# Altium project Ultrascale.PrjPcb (part 3 of 3)

## Sheet Sheet13.SchDoc
size A3
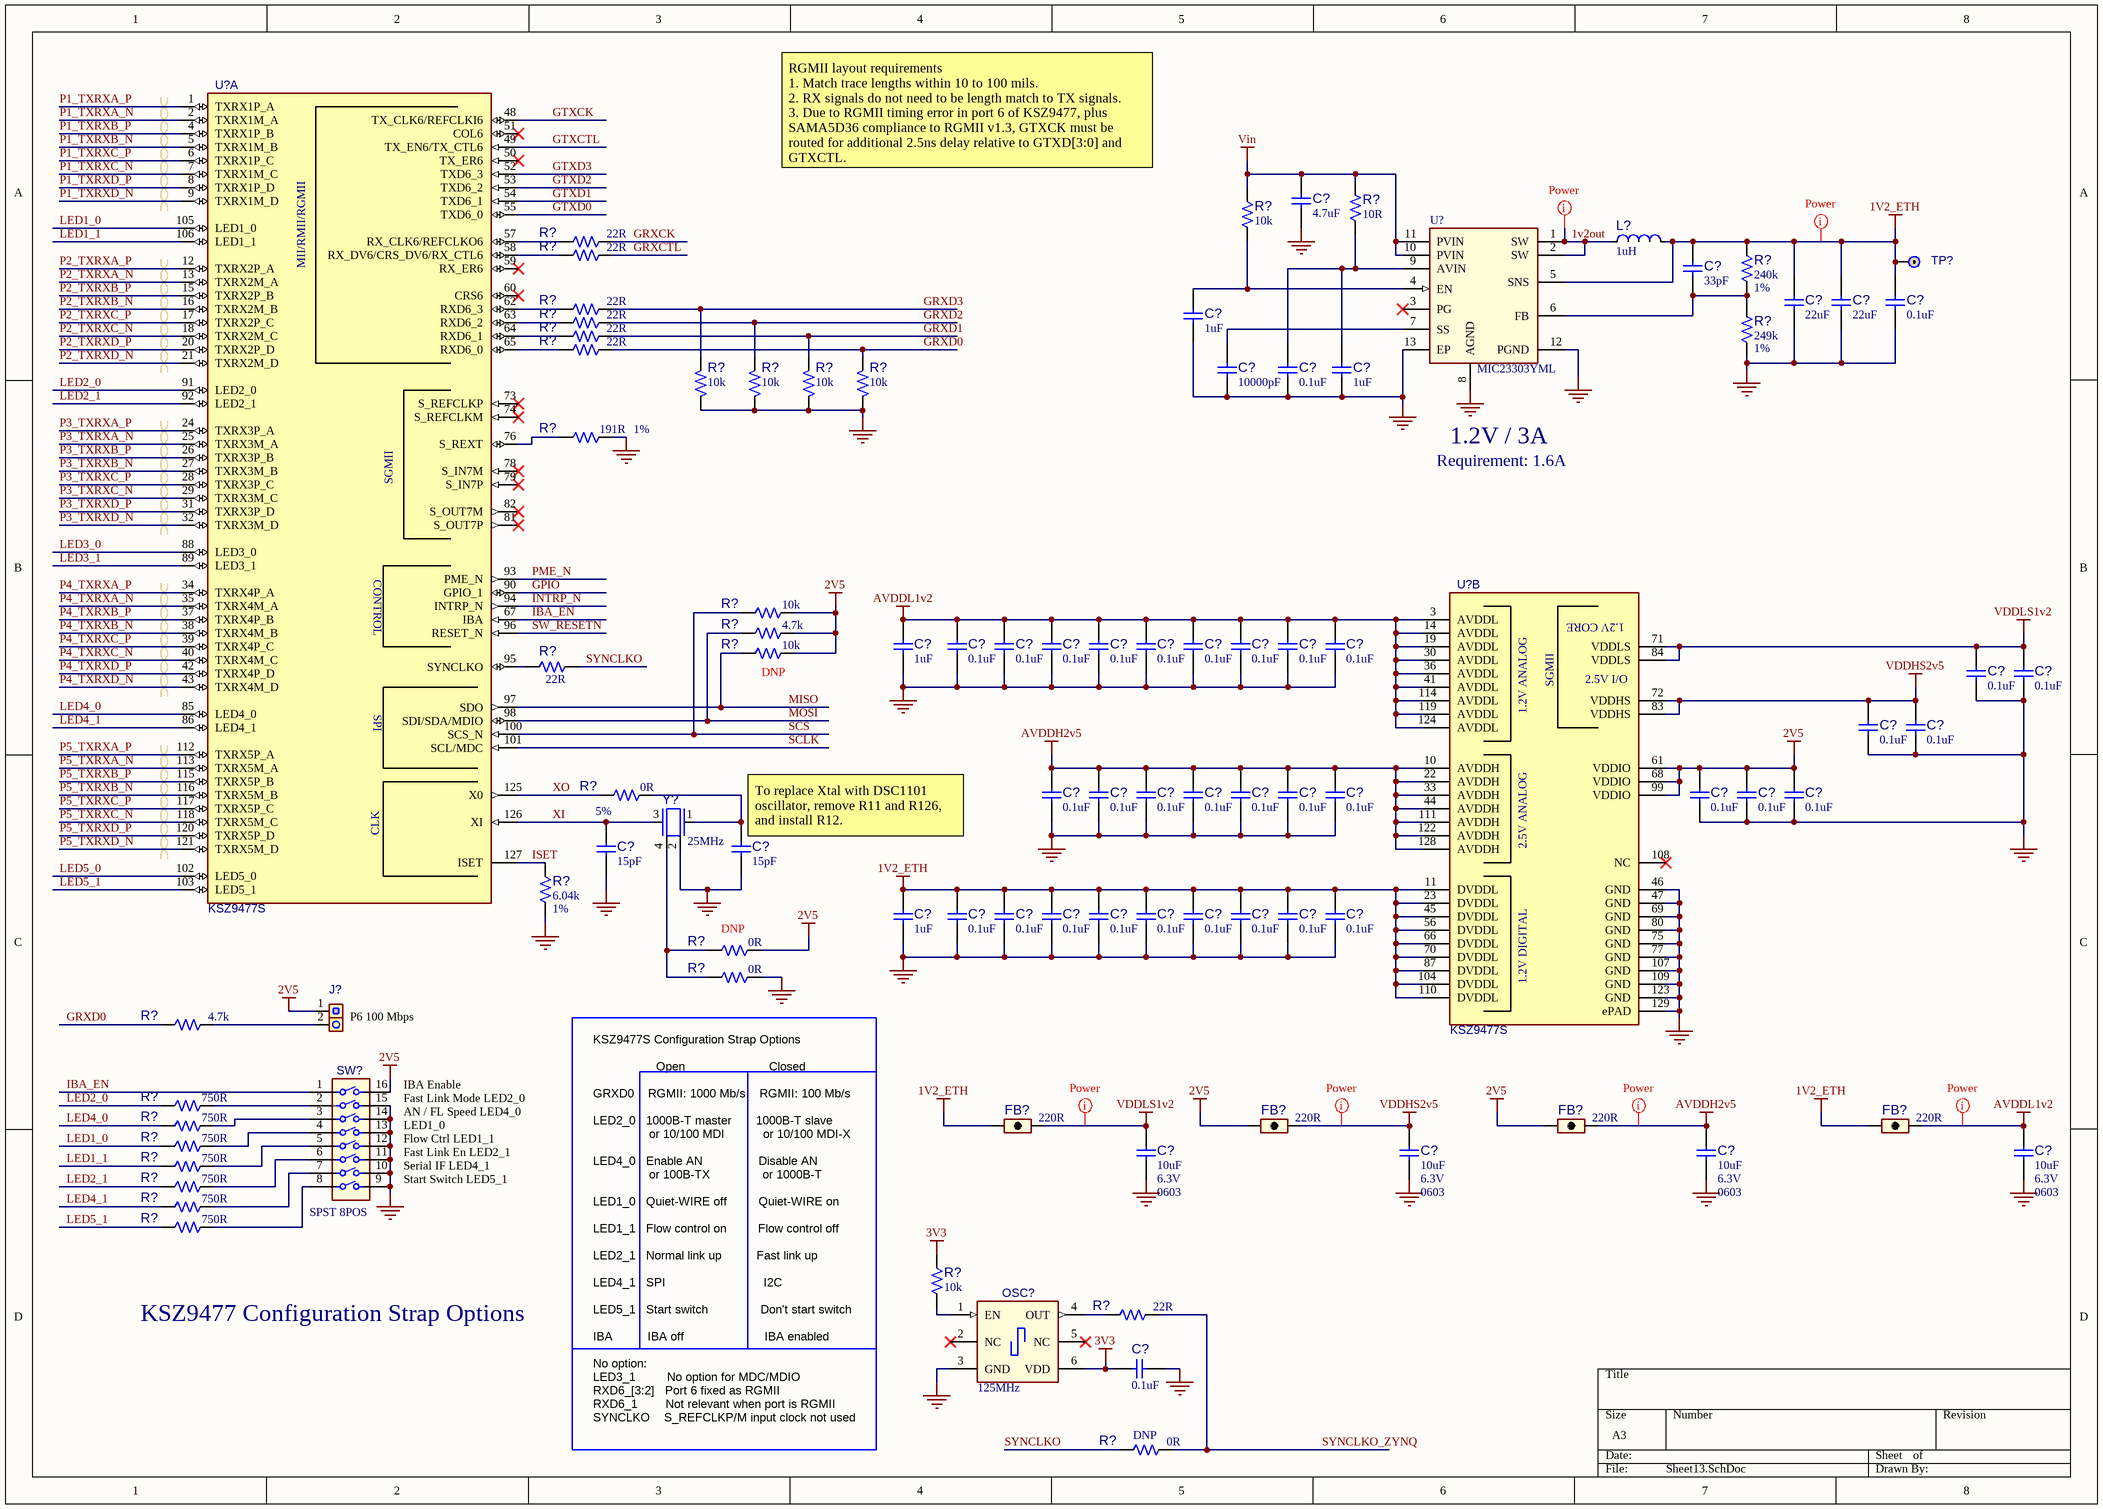
[diagram p7: Sheet13.SchDoc]

### Parts
(Parts that share a designator on the sheet are numbered #1, #2 ... from top to bottom, then left to right.)
C?#124  value 4.7uF  [CAP_C_0603]  (hidden comment: Capacitor NP)
C?#125  value 1uF  [CAP_C_0402]  (hidden comment: Capacitor NP)
C?#126  value 33pF  [CAP_C_0603]  (hidden comment: Capacitor NP)
C?#127  value 22uF  [CAP_C_0805]  (hidden comment: Capacitor NP)
C?#128  value 22uF  [CAP_C_0805]  (hidden comment: Capacitor NP)
C?#129  value 0.1uF  [CAP_C_0402]  (hidden comment: Capacitor NP)
C?#130  value 1uF  [CAP_C_0402]  (hidden comment: Capacitor NP)
C?#131  value 10000pF  [CAP_C_0402]  (hidden comment: Capacitor NP)
C?#132  value 0.1uF  [CAP_C_0402]  (hidden comment: Capacitor NP)
C?#133  value 1uF  [CAP_C_0402]  (hidden comment: Capacitor NP)
C?#134  value 0.1uF  [CAP_C_0402]  (hidden comment: Capacitor NP)
C?#135  value 0.1uF  [CAP_C_0402]  (hidden comment: Capacitor NP)
C?#136  value 0.1uF  [CAP_C_0402]  (hidden comment: Capacitor NP)
C?#137  value 0.1uF  [CAP_C_0402]  (hidden comment: Capacitor NP)
C?#138  value 0.1uF  [CAP_C_0402]  (hidden comment: Capacitor NP)
C?#139  value 0.1uF  [CAP_C_0402]  (hidden comment: Capacitor NP)
C?#140  value 0.1uF  [CAP_C_0402]  (hidden comment: Capacitor NP)
C?#141  value 0.1uF  [CAP_C_0402]  (hidden comment: Capacitor NP)
C?#142  value 0.1uF  [CAP_C_0402]  (hidden comment: Capacitor NP)
C?#143  value 0.1uF  [CAP_C_0402]  (hidden comment: Capacitor NP)
C?#144  value 0.1uF  [CAP_C_0402]  (hidden comment: Capacitor NP)
C?#145  value 0.1uF  [CAP_C_0402]  (hidden comment: Capacitor NP)
C?#146  value 0.1uF  [CAP_C_0402]  (hidden comment: Capacitor NP)
C?#147  value 0.1uF  [CAP_C_0402]  (hidden comment: Capacitor NP)
C?#148  value 0.1uF  [CAP_C_0402]  (hidden comment: Capacitor NP)
C?#149  value 0.1uF  [CAP_C_0402]  (hidden comment: Capacitor NP)
C?#150  value 0.1uF  [CAP_C_0402]  (hidden comment: Capacitor NP)
C?#151  value 0.1uF  [CAP_C_0402]  (hidden comment: Capacitor NP)
C?#152  value 0.1uF  [CAP_C_0402]  (hidden comment: Capacitor NP)
C?#153  value 0.1uF  [CAP_C_0402]  (hidden comment: Capacitor NP)
C?#154  value 0.1uF  [CAP_C_0402]  (hidden comment: Capacitor NP)
C?#155  value 0.1uF  [CAP_C_0402]  (hidden comment: Capacitor NP)
C?#156  value 0.1uF  [CAP_C_0402]  (hidden comment: Capacitor NP)
C?#157  value 15pF  Tolerance: 5%  [CAP_C_0402]  (hidden comment: Capacitor NP)
C?#158  value 15pF  [CAP_C_0402]  (hidden comment: Capacitor NP)
C?#159  value 1uF  [CAP_C_0402]  (hidden comment: Capacitor NP)
C?#160  value 0.1uF  [CAP_C_0402]  (hidden comment: Capacitor NP)
C?#161  value 0.1uF  [CAP_C_0402]  (hidden comment: Capacitor NP)
C?#162  value 0.1uF  [CAP_C_0402]  (hidden comment: Capacitor NP)
C?#163  value 0.1uF  [CAP_C_0402]  (hidden comment: Capacitor NP)
C?#164  value 0.1uF  [CAP_C_0402]  (hidden comment: Capacitor NP)
C?#165  value 0.1uF  [CAP_C_0402]  (hidden comment: Capacitor NP)
C?#166  value 0.1uF  [CAP_C_0402]  (hidden comment: Capacitor NP)
C?#167  value 0.1uF  [CAP_C_0402]  (hidden comment: Capacitor NP)
C?#168  value 0.1uF  [CAP_C_0402]  (hidden comment: Capacitor NP)
C?#169  value 10uF  Voltage: 6.3V  Package: 0603  [CAP_C_0603]  (hidden comment: Capacitor NP)
C?#170  value 10uF  Voltage: 6.3V  Package: 0603  [CAP_C_0603]  (hidden comment: Capacitor NP)
C?#171  value 10uF  Voltage: 6.3V  Package: 0603  [CAP_C_0603]  (hidden comment: Capacitor NP)
C?#172  value 10uF  Voltage: 6.3V  Package: 0603  [CAP_C_0603]  (hidden comment: Capacitor NP)
C?#173  value 0.1uF  [CAP_C_0402]  (hidden comment: Capacitor NP)
FB?#7  value 220R  [IND_C_0603]  (hidden comment: Ferrite Bead)
FB?#8  value 220R  [IND_C_0603]  (hidden comment: Ferrite Bead)
FB?#9  value 220R  [IND_C_0603]  (hidden comment: Ferrite Bead)
FB?#10  value 220R  [IND_C_0603]  (hidden comment: Ferrite Bead)
J?#2  HDR-2.54 Male 1x2  [HDR_M_2.54_1x2]  (value not drawn)
L?  value 1uH  [IND_TAI_NR_L3W3H1.5]  (hidden comment: Inductor)
OSC?  Frequency: 125MHz  [OSC_5MX3M2_A]
R?#42  value 10R  [RES_C_0603]  (hidden comment: Resistor)
R?#43  value 22R  [RES_C_0603]  (hidden comment: Resistor)
R?#44  value 10k  [RES_C_0603]  (hidden comment: Resistor)
R?#45  value 22R  [RES_C_0603]  (hidden comment: Resistor)
R?#46  value 240k  Tolerance: 1%  [RES_C_0603]  (hidden comment: Resistor)
R?#47  value 22R  [RES_C_0603]  (hidden comment: Resistor)
R?#48  value 22R  [RES_C_0603]  (hidden comment: Resistor)
R?#49  value 22R  [RES_C_0603]  (hidden comment: Resistor)
R?#50  value 22R  [RES_C_0603]  (hidden comment: Resistor)
R?#51  value 10k  [RES_C_0603]  (hidden comment: Resistor)
R?#52  value 10k  [RES_C_0603]  (hidden comment: Resistor)
R?#53  value 10k  [RES_C_0603]  (hidden comment: Resistor)
R?#54  value 10k  [RES_C_0603]  (hidden comment: Resistor)
R?#55  value 249k  Tolerance: 1%  [RES_C_0603]  (hidden comment: Resistor)
R?#56  value 191R  Tolerance: 1%  [RES_C_0603]  (hidden comment: Resistor)
R?#57  value 10k  [RES_C_0603]  (hidden comment: Resistor)
R?#58  value 4.7k  [RES_C_0603]  (hidden comment: Resistor)
R?#59  value 10k  Populated: DNP  [RES_C_0603]  (hidden comment: Resistor)
R?#60  value 22R  [RES_C_0603]  (hidden comment: Resistor)
R?#61  value 0R  [RES_C_0603]  (hidden comment: Resistor)
R?#62  value 6.04k  Tolerance: 1%  [RES_C_0603]  (hidden comment: Resistor)
R?#63  value 0R  Populated: DNP  [RES_C_0603]  (hidden comment: Resistor)
R?#64  value 0R  [RES_C_0603]  (hidden comment: Resistor)
R?#65  value 4.7k  [RES_C_0603]  (hidden comment: Resistor)
R?#66  value 750R  [RES_C_0603]  (hidden comment: Resistor)
R?#67  value 750R  [RES_C_0603]  (hidden comment: Resistor)
R?#68  value 750R  [RES_C_0603]  (hidden comment: Resistor)
R?#69  value 750R  [RES_C_0603]  (hidden comment: Resistor)
R?#70  value 750R  [RES_C_0603]  (hidden comment: Resistor)
R?#71  value 750R  [RES_C_0603]  (hidden comment: Resistor)
R?#72  value 750R  [RES_C_0603]  (hidden comment: Resistor)
R?#73  value 10k  [RES_C_0603]  (hidden comment: Resistor)
R?#74  value 22R  [RES_C_0603]  (hidden comment: Resistor)
R?#75  value 0R  Populated: DNP  [RES_C_0603]  (hidden comment: Resistor)
SW?  SPST 8POS  [SW_SM_8POS24V_TE]
TP?  Jumper  [TP_PAD51D36]  (value not drawn)  (no BOM)
U?#32  KSZ9477S  [TQFP-128_14x14_EP10x10]  (part A of 2)
U?#33  MIC23303YML  [DFN-12_3x3]
U?#34  KSZ9477S  [TQFP-128_14x14_EP10x10]  (part B of 2)
Y?  Frequency: 25MHz  [XTAL_4PIN_3M2X2M5]  (hidden comment: XTAL 25MHz 4 pins 3225)

### Nets
1V2_ETH: C?#126.2 C?#127.2 C?#128.2 C?#129.2 C?#159.2 C?#160.2 C?#161.2 C?#162.2 C?#163.2 C?#164.2 C?#165.2 C?#166.2 C?#167.2 C?#168.2 FB?#7.1 FB?#10.1 L?.2(F) R?#46.2 TP?.1(P1) U?#33.5(SNS) U?#34.11(DVDDL) U?#34.23(DVDDL) U?#34.45(DVDDL) U?#34.56(DVDDL) U?#34.66(DVDDL) U?#34.70(DVDDL) U?#34.87(DVDDL) U?#34.104(DVDDL) U?#34.110(DVDDL)
2V5: C?#154.2 C?#155.2 C?#156.2 FB?#8.1 FB?#9.1 J?#2.1(P1) R?#57.1 R?#58.1 R?#59.1 R?#63.2 SW?.16 U?#34.61(VDDIO) U?#34.68(VDDIO) U?#34.99(VDDIO)
3V3: C?#173.2 OSC?.6(VDD) R?#73.2
AVDDH2v5: C?#147.2 C?#148.2 C?#149.2 C?#150.2 C?#151.2 C?#152.2 C?#153.2 C?#171.2 FB?#9.2 U?#34.10(AVDDH) U?#34.22(AVDDH) U?#34.33(AVDDH) U?#34.44(AVDDH) U?#34.111(AVDDH) U?#34.122(AVDDH) U?#34.128(AVDDH)
AVDDL1v2: C?#133.2 C?#134.2 C?#135.2 C?#136.2 C?#137.2 C?#138.2 C?#139.2 C?#140.2 C?#141.2 C?#142.2 C?#172.2 FB?#10.2 U?#34.3(AVDDL) U?#34.14(AVDDL) U?#34.19(AVDDL) U?#34.30(AVDDL) U?#34.36(AVDDL) U?#34.41(AVDDL) U?#34.114(AVDDL) U?#34.119(AVDDL) U?#34.124(AVDDL)
GND: C?#124.1 C?#125.2 C?#127.1 C?#128.1 C?#129.1 C?#130.2 C?#131.1 C?#132.1 C?#133.1 C?#134.1 C?#135.1 C?#136.1 C?#137.1 C?#138.1 C?#139.1 C?#140.1 C?#141.1 C?#142.1 C?#143.1 C?#144.1 C?#145.1 C?#146.1 C?#147.1 C?#148.1 C?#149.1 C?#150.1 C?#151.1 C?#152.1 C?#153.1 C?#154.1 C?#155.1 C?#156.1 C?#157.1 C?#158.1 C?#159.1 C?#160.1 C?#161.1 C?#162.1 C?#163.1 C?#164.1 C?#165.1 C?#166.1 C?#167.1 C?#168.1 C?#169.1 C?#170.1 C?#171.1 C?#172.1 C?#173.1 OSC?.3(GND) R?#51.2 R?#52.2 R?#53.2 R?#54.2 R?#55.1 R?#56.2 R?#62.1 R?#64.2 SW?.9 SW?.10 SW?.11 SW?.12 SW?.13 SW?.14 SW?.15 U?#33.8(AGND) U?#33.12(PGND) U?#33.13(EP) U?#34.46(GND) U?#34.47(GND) U?#34.69(GND) U?#34.75(GND) U?#34.77(GND) U?#34.80(GND) U?#34.107(GND) U?#34.109(GND) U?#34.123(GND) U?#34.129(ePAD) Y?.2(GND)
VDDHS2v5: C?#145.2 C?#146.2 C?#170.2 FB?#8.2 U?#34.72(VDDHS) U?#34.83(VDDHS)
VDDLS1v2: C?#143.2 C?#144.2 C?#169.2 FB?#7.2 U?#34.71(VDDLS) U?#34.84(VDDLS)
Vin: C?#124.2 R?#42.2 R?#44.2 U?#33.10(PVIN) U?#33.11(PVIN)
1v2out: L?.1(S) U?#33.1(SW) U?#33.2(SW)
GPIO: U?#32.90(GPIO_1)
GRXCK: R?#43.2
GRXCTL: R?#45.2
GRXD0: R?#50.2 R?#54.1 R?#65.1
GRXD1: R?#49.2 R?#53.1
GRXD2: R?#48.2 R?#52.1
GRXD3: R?#47.2 R?#51.1
GTXCK: U?#32.48(TX_CLK6/REFCLKI6)
GTXCTL: U?#32.49(TX_EN6/TX_CTL6)
GTXD0: U?#32.55(TXD6_0)
GTXD1: U?#32.54(TXD6_1)
GTXD2: U?#32.53(TXD6_2)
GTXD3: U?#32.52(TXD6_3)
IBA_EN: SW?.1 U?#32.67(IBA)
INTRP_N: U?#32.94(INTRP_N)
ISET: R?#62.2 U?#32.127(ISET)
LED1_0: R?#68.1 U?#32.105(LED1_0)
LED1_1: R?#69.1 U?#32.106(LED1_1)
LED2_0: R?#66.1 U?#32.91(LED2_0)
LED2_1: R?#70.1 U?#32.92(LED2_1)
LED3_0: U?#32.88(LED3_0)
LED3_1: U?#32.89(LED3_1)
LED4_0: R?#67.1 U?#32.85(LED4_0)
LED4_1: R?#71.1 U?#32.86(LED4_1)
LED5_0: U?#32.102(LED5_0)
LED5_1: R?#72.1 U?#32.103(LED5_1)
MISO: R?#59.2 U?#32.97(SDO)
MOSI: R?#58.2 U?#32.98(SDI/SDA/MDIO)
P1_TXRXA_N: U?#32.2(TXRX1M_A)
P1_TXRXA_P: U?#32.1(TXRX1P_A)
P1_TXRXB_N: U?#32.5(TXRX1M_B)
P1_TXRXB_P: U?#32.4(TXRX1P_B)
P1_TXRXC_N: U?#32.7(TXRX1M_C)
P1_TXRXC_P: U?#32.6(TXRX1P_C)
P1_TXRXD_N: U?#32.9(TXRX1M_D)
P1_TXRXD_P: U?#32.8(TXRX1P_D)
P2_TXRXA_N: U?#32.13(TXRX2M_A)
P2_TXRXA_P: U?#32.12(TXRX2P_A)
P2_TXRXB_N: U?#32.16(TXRX2M_B)
P2_TXRXB_P: U?#32.15(TXRX2P_B)
P2_TXRXC_N: U?#32.18(TXRX2M_C)
P2_TXRXC_P: U?#32.17(TXRX2P_C)
P2_TXRXD_N: U?#32.21(TXRX2M_D)
P2_TXRXD_P: U?#32.20(TXRX2P_D)
P3_TXRXA_N: U?#32.25(TXRX3M_A)
P3_TXRXA_P: U?#32.24(TXRX3P_A)
P3_TXRXB_N: U?#32.27(TXRX3M_B)
P3_TXRXB_P: U?#32.26(TXRX3P_B)
P3_TXRXC_N: U?#32.29(TXRX3M_C)
P3_TXRXC_P: U?#32.28(TXRX3P_C)
P3_TXRXD_N: U?#32.32(TXRX3M_D)
P3_TXRXD_P: U?#32.31(TXRX3P_D)
P4_TXRXA_N: U?#32.35(TXRX4M_A)
P4_TXRXA_P: U?#32.34(TXRX4P_A)
P4_TXRXB_N: U?#32.38(TXRX4M_B)
P4_TXRXB_P: U?#32.37(TXRX4P_B)
P4_TXRXC_N: U?#32.40(TXRX4M_C)
P4_TXRXC_P: U?#32.39(TXRX4P_C)
P4_TXRXD_N: U?#32.43(TXRX4M_D)
P4_TXRXD_P: U?#32.42(TXRX4P_D)
P5_TXRXA_N: U?#32.113(TXRX5M_A)
P5_TXRXA_P: U?#32.112(TXRX5P_A)
P5_TXRXB_N: U?#32.116(TXRX5M_B)
P5_TXRXB_P: U?#32.115(TXRX5P_B)
P5_TXRXC_N: U?#32.118(TXRX5M_C)
P5_TXRXC_P: U?#32.117(TXRX5P_C)
P5_TXRXD_N: U?#32.121(TXRX5M_D)
P5_TXRXD_P: U?#32.120(TXRX5P_D)
PME_N: U?#32.93(PME_N)
SCLK: U?#32.101(SCL/MDC)
SCS: R?#57.2 U?#32.100(SCS_N)
SW_RESETN: U?#32.96(RESET_N)
SYNCLKO: R?#60.2 R?#75.1
SYNCLKO_ZYNQ: R?#74.2 R?#75.2
XI: C?#157.2 U?#32.126(XI) Y?.3(Osc2)
XO: R?#61.1 U?#32.125(X0)
NetC?#125_1: C?#125.1 R?#44.1 U?#33.4(EN)
NetC?#126_1: C?#126.1 R?#46.1 R?#55.2 U?#33.6(FB)
NetC?#130_1: C?#130.1 C?#132.2 R?#42.1 U?#33.9(AVIN)
NetC?#131_2: C?#131.2 U?#33.7(SS)
NetC?#158_2: C?#158.2 R?#61.2 Y?.1(Osc1)
NetJ?#2_2: J?#2.2(P2) R?#65.2
NetOSC?_1: OSC?.1(EN) R?#73.1
NetOSC?_4: OSC?.4(OUT) R?#74.1
NetR?#43_1: R?#43.1 U?#32.57(RX_CLK6/REFCLKO6)
NetR?#45_1: R?#45.1 U?#32.58(RX_DV6/CRS_DV6/RX_CTL6)
NetR?#47_1: R?#47.1 U?#32.62(RXD6_3)
NetR?#48_1: R?#48.1 U?#32.63(RXD6_2)
NetR?#49_1: R?#49.1 U?#32.64(RXD6_1)
NetR?#50_1: R?#50.1 U?#32.65(RXD6_0)
NetR?#56_1: R?#56.1 U?#32.76(S_REXT)
NetR?#60_1: R?#60.1 U?#32.95(SYNCLKO)
NetR?#63_1: R?#63.1 R?#64.1 Y?.4(GND)
NetR?#66_2: R?#66.2 SW?.2
NetR?#67_2: R?#67.2 SW?.3
NetR?#68_2: R?#68.2 SW?.4
NetR?#69_2: R?#69.2 SW?.5
NetR?#70_2: R?#70.2 SW?.6
NetR?#71_2: R?#71.2 SW?.7
NetR?#72_2: R?#72.2 SW?.8

Not connected (* = marked no-connect by the designer): OSC? 2(NC)* 5(NC)*; U?#32 50(TX_ER6)* 51(COL6)* 59(RX_ER6)* 60(CRS6)* 73(S_REFCLKP)* 74(S_REFCLKM)* 78(S_IN7M)* 79(S_IN7P)* 81(S_OUT7P)* 82(S_OUT7M)*; U?#33 3(PG)*; U?#34 108(NC)*

### Layout directives
differential pair; net class Enet; net class Enet1.: P1_TXRXA_N, P1_TXRXA_P, P1_TXRXB_N, P1_TXRXB_P, P1_TXRXC_N, P1_TXRXC_P, P1_TXRXD_N, P1_TXRXD_P
differential pair; net class Enet; net class Enet2.: P2_TXRXA_N, P2_TXRXA_P, P2_TXRXB_N, P2_TXRXB_P, P2_TXRXC_N, P2_TXRXC_P, P2_TXRXD_N, P2_TXRXD_P
differential pair; net class Enet; net class Enet3.: P3_TXRXA_N, P3_TXRXA_P, P3_TXRXB_N, P3_TXRXB_P, P3_TXRXC_N, P3_TXRXC_P, P3_TXRXD_N, P3_TXRXD_P
differential pair; net class Enet; net class Enet4.: P4_TXRXA_N, P4_TXRXA_P, P4_TXRXB_N, P4_TXRXB_P, P4_TXRXC_N, P4_TXRXC_P, P4_TXRXD_N, P4_TXRXD_P
differential pair; net class Enet; net class Enet5.: P5_TXRXA_N, P5_TXRXA_P, P5_TXRXB_N, P5_TXRXB_P, P5_TXRXC_N, P5_TXRXC_P, P5_TXRXD_N, P5_TXRXD_P
net class Power (VBUS): 1V2_ETH, 1v2out, AVDDH2v5, AVDDL1v2, VDDHS2v5, VDDLS1v2

### Notes on the sheet
- RGMII layout requirements
  1. Match trace lengths within 10 to 100 mils.
  2. RX signals do not need to be length match to TX signals.
  3. Due to RGMII timing error in port 6 of KSZ9477, plus SAMA5D36 compliance to RGMII v1.3, GTXCK must be routed for additional 2.5ns delay relative to GTXD[3:0] and GTXCTL.
- 1.2V / 3A
- Requirement: 1.6A
- (near C?#158) To replace Xtal with DSC1101 oscillator, remove R11 and R126, and install R12.
- (near J?#2) P6 100 Mbps
- (near SW?) Fast Link Mode LED2_0
- (near SW?) AN / FL Speed LED4_0
- (near SW?) IBA Enable
- (near SW?) LED1_0
- (near SW?) Flow Ctrl LED1_1
- (near SW?) Fast Link En LED2_1
- (near SW?) Serial IF LED4_1
- (near SW?) Start Switch LED5_1
- KSZ9477 Configuration Strap Options
- KSZ9477S Configuration Strap Options
  Open                        Closed
  GRXD0    RGMII: 1000 Mb/s    RGMII: 100 Mb/s
  LED2_0   1000B-T master       1000B-T slave
  or 10/100 MDI           or 10/100 MDI-X
  LED4_0   Enable AN                Disable AN
  or 100B-TX               or 1000B-T
  LED1_0   Quiet-WIRE off         Quiet-WIRE on
  LED1_1   Flow control on         Flow control off
  LED2_1   Normal link up          Fast link up
  LED4_1   SPI                            I2C
  LED5_1   Start switch               Don't start switch
  IBA          IBA off                       IBA enabled
  No option:
  LED3_1         No option for MDC/MDIO
  RXD6_[3:2]   Port 6 fixed as RGMII
  RXD6_1        Not relevant when port is RGMII
  SYNCLKO    S_REFCLKP/M input clock not used
- (in symbol KSZ9477S_TQFP128, part A) MII/RMII/RGMII; SGMII; CONTROL; SPI; CLK
- (in symbol KSZ9477S_TQFP128, part B) 1.2V CORE; SGMII; 2.5V I/O; 1.2V ANALOG; 2.5V ANALOG; 1.2V DIGITAL

### Library data of the parts
C?#124 = CAP1288: Capacitor; Manufacturer 1: TDK Corporation; Manufacturer Part Number 1: C1608X5R1C475K080AC; Voltage: 16V; Description_: CAP CER 4.7uF 16V 10% X5R SMD 0603; Dev Tools Status: Production; Tolerance: 10%; Temperature Coeffcient: X5R; Type: Ceramic; Owner: Jairuz Agang-ang; Populated: YES; MCHP-ID: CAP1288; Package: 0603; Revision: 1; Status: MCL Design; ComponentLink1URL: https://chn-vm-apps.microchip.com/mchprepo/parts/Datasheets/mlcc_commercial_general_en.pdf; ComponentLink1Description: Datasheet; Operating Temperature: -55C to +85C; Category: Capacitor; Supplier 1: Digi-Key; Supplier Part Number 1: 445-7478-1-ND; Quantity Override: 1
C?#125 C?#130 C?#133 C?#159 = CAP1065: Capacitor; Manufacturer 1: TDK Corporation; Manufacturer Part Number 1: C1005X5R1C105K; Voltage: 16V; Description_: CAP CER 1uF 16V 10% X5R SMD 0402; Dev Tools Status: Production; Tolerance: 10%; Temperature Coeffcient: X5R; Type: Ceramic; Owner: Tad Ahlvers; Populated: YES; MCHP-ID: CAP1065; Package: 0402; Revision: 1; Status: MCL Design; ComponentLink1URL: https://chn-vm-apps.microchip.com/mchprepo/parts/Datasheets/general_B11.pdf; ComponentLink1Description: Datasheet; Operating Temperature: -55C to +85C; Category: Capacitor; Supplier 1: Digi-Key; Supplier Part Number 1: 445-4978-2-ND; Quantity Override: 1
C?#126 = CAP0088: Capacitor; Manufacturer 1: Cal-Chip; Manufacturer Part Number 1: GMC10CG330J50NTLF; Voltage: 50V; Description_: CAP CER 33pF 50V 5% NP0 SMD 0603; Dev Tools Status: Production; Tolerance: 5%; Temperature Coeffcient: NP0; Type: Ceramic; Populated: Yes; MCHP-ID: CAP0088; Package: 0603; Revision: 1; Status: MCL Design; ComponentLink1URL: https://chn-vm-apps.microchip.com/mchprepo/parts/Datasheets/KEM_C1002_X7R_SMD.pdf; ComponentLink1Description: Datasheet; Operating Temperature: -55C to +125C; Category: Capacitor; Manufacturer 2: KEMET; Manufacturer Part Number 2: C0603C330J5GACTU; Manufacturer 3: Panasonic; Manufacturer Part Number 3: ECU-V1H330JCV; Manufacturer 4: TDK; Manufacturer Part Number 4: C1608C0G1H330J; Manufacturer 5: Yageo; Manufacturer Part Number 5: CC0603JRNP09BN330; Manufacturer 6: NIC Components; Manufacturer Part Number 6: NMC0603NPO330J50TRPF; Manufacturer 7: Panasonic; Manufacturer Part Number 7: ECJ-1VC1H330J; Supplier 1: Cal-Chip; Supplier Part Number 1: GMC10CG330J50NTLF; Supplier 2: Digi-Key; Supplier Part Number 2: 399-1055-1-ND; Supplier 3: Digi-Key; Supplier Part Number 3: PCC330ACVTR-ND; Supplier 4: Digi-Key; Supplier Part Number 4: 445-1275-2-ND; Supplier 5: Digi-Key; Supplier Part Number 5: 311-1064-1-ND; Supplier 6: NIC Components; Supplier Part Number 6: NMC0603NPO330J50TRPF; Supplier 7: Panasonic; Supplier Part Number 7: ECJ-1VC1H330J; Quantity Override: 1
C?#127 C?#128 = CAP0627: Capacitor; Manufacturer 1: TDK; Manufacturer Part Number 1: C2012X5R1C226K; Voltage: 16V; Description_: CAP CER 22uF 16V 10% X5R SMD 0805; Dev Tools Status: Production; Tolerance: 10%; Temperature Coeffcient: X5R; Type: Ceramic; Populated: Yes; MCHP-ID: CAP0627; Package: 0805; Revision: 1; Status: MCL Design; ComponentLink1URL: https://chn-vm-apps.microchip.com/mchprepo/parts/Datasheets/general_B11.pdf; ComponentLink1Description: Datasheet; Operating Temperature: -55C to +85C; Category: Capacitor; Supplier 1: Digi-Key; Supplier Part Number 1: 445-6797-2-ND; Quantity Override: 1
C?#129 C?#132 C?#134-C?#156 C?#160-C?#168 C?#173 = CAP1463: Capacitor; Manufacturer 1: TDK Corporation; Manufacturer Part Number 1: C1005X7R1H104K050BB; Voltage: 50V; Description_: CAP CER 0.1uF 50V 10% X7R SMD 0402; Dev Tools Status: Design; Tolerance: 10%; Temperature Coeffcient: X7R; Type: Ceramic; Owner: Jamus Griego; Populated: YES; MCHP-ID: CAP1463; Package: 0402; Revision: A; Status: MCL Design; ComponentLink1URL: https://chn-vm-apps.microchip.com/mchprepo/parts/Datasheets/TDKMLCCCapRange.pdf; ComponentLink1Description: Datasheets; Operating Temperature: -55C to +125C; Category: Capacitor; Supplier 1: Digi-Key; Supplier Part Number 1: 445-5932-1-ND; Quantity Override: 1
C?#131 = CAP0278: Capacitor; Manufacturer 1: KEMET; Manufacturer Part Number 1: C0402C103K4RACTU; Voltage: 16V; Description_: CAP CER 10000pF 16V 10% X7R SMD 0402; Dev Tools Status: Production; Tolerance: 10%; Temperature Coeffcient: X7R; Type: Ceramic; Populated: YES; MCHP-ID: CAP0278; Package: 0402; Revision: 1; Status: MCL Design; ComponentLink1URL: https://chn-vm-apps.microchip.com/mchprepo/parts/Datasheets/KEM_C1002_X7R_SMD.pdf; ComponentLink1Description: Datasheet; Operating Temperature: -55C to +125C; Category: Capacitor; Manufacturer 2: KEMET; Manufacturer Part Number 2: C0402C103K4RAC; Supplier 1: Digi-Key; Supplier Part Number 1: 399-1038-1-ND; Supplier 2: KEMET; Supplier Part Number 2: C0402C103K4RAC; Quantity Override: 1
C?#157 = CAP0608: Capacitor; Manufacturer 1: Murata; Manufacturer Part Number 1: GRM1555C1H150JA01D; Voltage: 50V; Description_: CAP CER 15pF 50V 5% NP0 SMD 0402; Dev Tools Status: Production; Temperature Coeffcient: NP0; Type: Ceramic; Populated: Yes; MCHP-ID: CAP0608; Package: 0402; Revision: 1; Status: MCL Design; ComponentLink1URL: https://chn-vm-apps.microchip.com/mchprepo/parts/Datasheets/L0005E.pdf; ComponentLink1Description: Datasheet; Operating Temperature: -55C to +125C; Category: Capacitor; Manufacturer 2: Murata; Manufacturer Part Number 2: GRM1555C1H150JZ01D; Supplier 1: Digi-Key; Supplier Part Number 1: 490-5888-2-ND; Supplier 2: Digi-Key; Supplier Part Number 2: 490-1280-1-ND; Quantity Override: 1
C?#158 = CAP0608: Capacitor; Manufacturer 1: Murata; Manufacturer Part Number 1: GRM1555C1H150JA01D; Voltage: 50V; Description_: CAP CER 15pF 50V 5% NP0 SMD 0402; Dev Tools Status: Production; Tolerance: 5%; Temperature Coeffcient: NP0; Type: Ceramic; Populated: Yes; MCHP-ID: CAP0608; Package: 0402; Revision: 1; Status: MCL Design; ComponentLink1URL: https://chn-vm-apps.microchip.com/mchprepo/parts/Datasheets/L0005E.pdf; ComponentLink1Description: Datasheet; Operating Temperature: -55C to +125C; Category: Capacitor; Manufacturer 2: Murata; Manufacturer Part Number 2: GRM1555C1H150JZ01D; Supplier 1: Digi-Key; Supplier Part Number 1: 490-5888-2-ND; Supplier 2: Digi-Key; Supplier Part Number 2: 490-1280-1-ND; Quantity Override: 1
C?#169-C?#172 = CAP0533: Capacitor; Manufacturer 1: AVX; Manufacturer Part Number 1: 06036D106MAT2A; Description_: CAP CER 10uF 6.3V 20% X5R SMD 0603; Dev Tools Status: Production; Tolerance: 20%; Temperature Coeffcient: X5R; Type: Ceramic; Populated: Yes; MCHP-ID: CAP0533; Revision: 1; Status: MCL Design; ComponentLink1URL: https://chn-vm-apps.microchip.com/mchprepo/parts/Datasheets/smccp.pdf; ComponentLink1Description: Datasheet; Operating Temperature: -55C to +85C; Category: Capacitor; Manufacturer 2: KEMET; Manufacturer Part Number 2: C0603C106M9PACTU; Manufacturer 3: Murata; Manufacturer Part Number 3: GRM188R60J106ME47D; Manufacturer 4: TDK Corporation; Manufacturer Part Number 4: C1608X5R0J106M080AB; Manufacturer 5: TDK Corporation; Manufacturer Part Number 5: C1608X5R0J106M; Supplier 1: Digi-Key; Supplier Part Number 1: 478-5318-2-ND; Supplier 2: Digi-Key; Supplier Part Number 2: 399-5504-1-ND; Supplier 3: Digi-Key; Supplier Part Number 3: 490-3896-2-ND; Supplier 4: Digi-Key; Supplier Part Number 4: 445-4112-1-ND; Quantity Override: 1
FB?#7-FB?#10 = IND1313: Manufacturer 1: Murata Electronics North America; Manufacturer Part Number 1: BLM18EG221SN1D; Description_: FERRITE 220R @ 100MHz 2A SMD 0603; Dev Tools Status: Design; Owner: Razvan Cristescu; Populated: YES; MCHP-ID: IND1313; Revision: A; Symbol: Ferrite Bead; Status: MCL Design; ComponentLink1Description: Datasheet; Package: 0603; Type: Ferrite Bead; Category: Inductor; Supplier 1: Digi-Key; Supplier Part Number 1: 490-3992-6-ND; Quantity Override: 1
J?#2 = Header 1x2: CONN HEADER 2POS .100" SGL GOLD; Manufacturer Part Number 1: TSW-102-07-G-S; Manufacturer 1: Samtec; Part Checked: Jennifer Hancock; Description_: CON HDR-2.54 MALE 1x2 GOLD 5.84MH TH VERT; Populated: Yes; Package: Through Hole; Supplier 1: Digi-Key; Supplier Part Number 1: SAM1029-02-ND; Value: HDR-2.54 Male 1x2; Part Footprint Checked: *; Part Golden: Jennifer Hancock; Part 3D Model Checked: Jennifer Hancock; Manufacturer 2: FCI; Manufacturer Part Number 2: 68000-236HLF; Revision Date: 08/14/2015; Tolerance: *; Rating: *; Owner: *; Document Link: //depot_np_hweng_boards/altium_libraries/datasheets/Samtec/TSW_TH.pdf
L? = IND1027: Manufacturer 1: Taiyo Yuden; Manufacturer Part Number 1: NR3015T1R0N; Description_: INDUCTOR 1uH 2.1A 30% SMD L3W3H1.5; Dev Tools Status: Production; Owner: Tad Ahlvers; DCR: 0.036R; Saturation Current: 2.1A; Test Frequency: 100kHz; Populated: YES; MCHP-ID: IND1027; Revision: 1; Status: MCL Design; ComponentLink1URL: https://chn-vm-apps.microchip.com/mchprepo/parts/Datasheets/NR3015T1R0N.pdf; ComponentLink1Description: Datasheet; Operating Temperature: -25C to +120C; Package: L3W3H1.5; Type: Inductor; Category: Inductor; Supplier 1: Digi-Key; Supplier Part Number 1: 587-1647-1-ND; Quantity Override: 1
OSC? = DSC1101B12-125.0000: OSC MEMS 125.000MHZ CMOS SMD; Manufacturer 1: Micrel; Manufacturer Part Number 1: DSC1101BI2-125.0000; Populated: Yes; Supplier 1: Digi-Key; Category: Crystals and Oscillators; ComponentLink1URL: http://www.ctscorp.com/components/Datasheets/008-0256-0.pdf; ComponentLink1Description: Datasheet; Description_: OSC MEMS 125.000MHZ CMOS SMD; RoHS: RoHS Compliant; Package: 5.0mm x 3.2mm
R?#42 = RSMT1021: Manufacturer 1: Stackpole Electronics Inc; Manufacturer Part Number 1: RMCF0603FT10R0; Tolerance: 1%; Description_: RES TKF 10R 1% 1/10W SMD 0603; Dev Tools Status: Production; Voltage: 50V; Temperature Coeffcient: 100ppm/C; Current: 1A; Power: 1/10W; Owner: Aaron VanDuerm; Populated: Yes; MCHP-ID: RSMT1021; Package: 0603; Revision: 1; Status: MCL Design; ComponentLink1URL: https://chn-vm-apps.microchip.com/mchprepo/parts/Datasheets/SEI-RMCF_RMCP.pdf; ComponentLink1Description: Datasheet; Operating Temperature: -55C to +155C; Category: Resistor; Type: RES SMD; Composition: TKF; Supplier 1: Digi-Key; Supplier Part Number 1: RMCF0603FT10R0CT-ND; Quantity Override: 1
R?#43 R?#45 R?#47-R?#50 R?#60 R?#74 = RSMT0454: Manufacturer 1: Yageo; Manufacturer Part Number 1: RC0603FR-0722RL; Tolerance: 1%; Description_: RES TKF 22R 1% 1/10W SMD 0603; Dev Tools Status: Production; Voltage: 50V; Temperature Coeffcient: 100ppm/C; Power: 1/10W; Populated: YES; MCHP-ID: RSMT0454; Package: 0603; Revision: 2; Status: MCL Design; ComponentLink1URL: https://chn-vm-apps.microchip.com/mchprepo/parts/Datasheets/PYu-RC0603_51_RoHS_L_4.pdf; ComponentLink1Description: Datasheet; Operating Temperature: -55C to +155C; Category: Resistor; Type: RES SMD; Composition: TKF; Supplier 1: Digi-Key; Supplier Part Number 1: 311-22.0HRCT-ND; Quantity Override: 1
R?#44 R?#51-R?#54 R?#57 R?#73 = RSMT0139: Manufacturer 1: Panasonic; Manufacturer Part Number 1: ERJ-3EKF1002V; Tolerance: 1%; Description_: RES TKF 10k 1% 1/10W SMD 0603; Dev Tools Status: Production; Temperature Coeffcient: 100ppm/C; Power: 1/10W; Populated: Yes; MCHP-ID: RSMT0139; Package: 0603; Revision: 2; Status: MCL Design; ComponentLink1URL: https://chn-vm-apps.microchip.com/mchprepo/parts/Datasheets/nrc.pdf; ComponentLink1Description: Datasheet; Operating Temperature: -55C to +155C; Category: Resistor; Type: RES SMD; Composition: TKF; Manufacturer 2: Stackpole Electronics Inc; Manufacturer Part Number 2: RMCF0603FT10K0; Manufacturer 3: Yageo; Manufacturer Part Number 3: RC0603FR-0710KL; Manufacturer 4: Stackpole Electronics Inc; Manufacturer Part Number 4: RMCF 1/16 10K 1% R; Manufacturer 5: Xicon; Manufacturer Part Number 5: 302-10K-RC; Manufacturer 6: NIC Components; Manufacturer Part Number 6: NRC06F1002TRF; Supplier 1: Digi-Key; Supplier Part Number 1: P10.0KHCT-ND; Supplier 2: Digi-Key; Supplier Part Number 2: RMCF1/1610KFRTR-ND; Supplier 3: Digi-Key; Supplier Part Number 3: 311-10.0KHRCT-ND; Supplier 4: Digi-Key; Supplier Part Number 4: RMCF0603FT10K0TR-ND; Supplier 5: Mouser; Supplier Part Number 5: 302-10k-RC; Supplier 6: NIC Components; Supplier Part Number 6: NRC06F1002TRF; Quantity Override: 1
R?#46 = RES1562: Manufacturer 1: Panasonic Electronic Components; Manufacturer Part Number 1: ERJ-3EKF2403V; Description_: RES TKF 240k 1% 1/10W SMD 0603; Dev Tools Status: Design; Voltage: 75V; Temperature Coeffcient: 100ppm/C; Power: 1/10W; Owner: Tad Ahlvers; Populated: YES; MCHP-ID: RES1562; Package: 0603; Revision: A; Status: MCL Design; ComponentLink1URL: https://chn-vm-apps.microchip.com/mchprepo/parts/Datasheets/AOA0000CE2.pdf; ComponentLink1Description: Datasheet; Operating Temperature: -55C to +155C; Category: Resistor; Type: RES SMD; Composition: TKF; Supplier 1: Digi-Key; Supplier Part Number 1: P240KHCT-ND; Quantity Override: 1
R?#55 = RSMT0556: Manufacturer 1: Panasonic; Manufacturer Part Number 1: ERJ-3EKF2493V; Description_: RES TKF 249k 1% 1/10W SMD 0603; Dev Tools Status: Production; Voltage: 75V; Temperature Coeffcient: 100ppm/C; Power: 1/10W; Populated: Yes; MCHP-ID: RSMT0556; Package: 0603; Revision: 1; Status: MCL Design; ComponentLink1URL: https://chn-vm-apps.microchip.com/mchprepo/parts/Datasheets/AOA0000CE2.pdf; ComponentLink1Description: Datasheet; Operating Temperature: -55C to +155C; Category: Resistor; Type: RES SMD; Composition: TKF; Supplier 1: Digi-Key; Supplier Part Number 1: P249KHCT-ND; Quantity Override: 1
R?#56 = RES1665: Manufacturer 1: Yageo; Manufacturer Part Number 1: RC0603FR-07191RL; Description_: RES TKF 191R 1% 1/10W SMD 0603; Dev Tools Status: Design; Temperature Coeffcient: ±100ppm/°C; Power: 1/10W; Owner: Sam Charles; Populated: YES; MCHP-ID: RES1665; Package: 0603; Revision: A; Symbol: RESISTOR; Status: MCL Design; ComponentLink1URL: https://chn-vm-apps.microchip.com/mchprepo/parts/Datasheets/PYu-R_INT-thick_7.pdf; ComponentLink1Description: datasheet; Operating Temperature: -55°C ~ 155°C; Category: Resistor; Type: RES SMD; Composition: TKF; Supplier 1: Digi-Key; Supplier Part Number 1: 311-191HRCT-ND; Quantity Override: 1
R?#58 R?#65 = RSMT0713: Manufacturer 1: ROHM; Manufacturer Part Number 1: MCR03EZPFX4701; Tolerance: 1%; Description_: RES TKF 4.7k 1% 1/10W SMD 0603; Dev Tools Status: Production; Voltage: 50V; Temperature Coeffcient: 100ppm/C; Current: 1A; Power: 1/10W; Populated: Yes; MCHP-ID: RSMT0713; Package: 0603; Revision: 2; Status: MCL Design; ComponentLink1URL: https://chn-vm-apps.microchip.com/mchprepo/parts/Datasheets/SEI-RMCF_RMCP.pdf; ComponentLink1Description: Datasheet; Operating Temperature: -55C to +155C; Category: Resistor; Type: RES SMD; Composition: TKF; Manufacturer 2: Stackpole Electronics Inc; Manufacturer Part Number 2: RMCF0603FT4K70; Manufacturer 3: Yageo; Manufacturer Part Number 3: RC0603FR-074K7L; Supplier 1: Digi-Key; Supplier Part Number 1: RHM4.70KHCT-ND; Supplier 2: Digi-Key; Supplier Part Number 2: RMCF0603FT4K70CT-ND; Supplier 3: Digi-Key; Supplier Part Number 3: 311-4.70KHRTR-ND; Quantity Override: 1
R?#59 = RSMT0139: Manufacturer 1: Panasonic; Manufacturer Part Number 1: ERJ-3EKF1002V; Tolerance: 1%; Description_: RES TKF 10k 1% 1/10W SMD 0603; Dev Tools Status: Production; Temperature Coeffcient: 100ppm/C; Power: 1/10W; MCHP-ID: RSMT0139; Package: 0603; Revision: 2; Status: MCL Design; ComponentLink1URL: https://chn-vm-apps.microchip.com/mchprepo/parts/Datasheets/nrc.pdf; ComponentLink1Description: Datasheet; Operating Temperature: -55C to +155C; Category: Resistor; Type: RES SMD; Composition: TKF; Manufacturer 2: Stackpole Electronics Inc; Manufacturer Part Number 2: RMCF0603FT10K0; Manufacturer 3: Yageo; Manufacturer Part Number 3: RC0603FR-0710KL; Manufacturer 4: Stackpole Electronics Inc; Manufacturer Part Number 4: RMCF 1/16 10K 1% R; Manufacturer 5: Xicon; Manufacturer Part Number 5: 302-10K-RC; Manufacturer 6: NIC Components; Manufacturer Part Number 6: NRC06F1002TRF; Supplier 1: Digi-Key; Supplier Part Number 1: P10.0KHCT-ND; Supplier 2: Digi-Key; Supplier Part Number 2: RMCF1/1610KFRTR-ND; Supplier 3: Digi-Key; Supplier Part Number 3: 311-10.0KHRCT-ND; Supplier 4: Digi-Key; Supplier Part Number 4: RMCF0603FT10K0TR-ND; Supplier 5: Mouser; Supplier Part Number 5: 302-10k-RC; Supplier 6: NIC Components; Supplier Part Number 6: NRC06F1002TRF; Quantity Override: 1
R?#61 R?#64 = RSMT0001: Manufacturer 1: Panasonic; Manufacturer Part Number 1: ERJ-3GSY0R00V; Description_: RES TKF 0R 1/10W SMD 0603; Dev Tools Status: Production; Power: 1/10W; Populated: Yes; MCHP-ID: RSMT0001; Package: 0603; Revision: 2; Status: MCL Design; ComponentLink1URL: https://chn-vm-apps.microchip.com/mchprepo/parts/Datasheets/nrc.pdf; ComponentLink1Description: Datasheet; Operating Temperature: -55C to +155C; Category: Resistor; Type: RES SMD; Composition: TKF; Manufacturer 2: Panasonic; Manufacturer Part Number 2: ERJ-3GEY0R00V; Manufacturer 3: ROHM; Manufacturer Part Number 3: MCR03EZPJ000; Manufacturer 4: Stackpole Electronics Inc; Manufacturer Part Number 4: RMCF0603ZT0R00; Manufacturer 5: Stackpole Electronics Inc; Manufacturer Part Number 5: RMCF 1/16 0 R; Manufacturer 6: Vishay; Manufacturer Part Number 6: CRCW06030000Z0EA; Manufacturer 7: Yageo; Manufacturer Part Number 7: RC0603JR-070RL; Manufacturer 8: KOA Speer; Manufacturer Part Number 8: RK73Z1JTTP; Manufacturer 9: NIC Components; Manufacturer Part Number 9: NRC06Z0TRF; Supplier 1: Digi-Key; Supplier Part Number 1: P0.0GTR-ND; Supplier 2: Digi-Key; Supplier Part Number 2: RHM0.0GCT-ND; Supplier 3: Digi-Key; Supplier Part Number 3: RMCF0603ZT0R00TR-ND; Supplier 4: Digi-Key; Supplier Part Number 4: RMCF0603ZT0R00CT-ND; Supplier 5: Digi-Key; Supplier Part Number 5: RMCF1/160RTR-ND; Supplier 6: Digi-Key; Supplier Part Number 6: 541-0.0GCT-ND; Supplier 7: Digi-Key; Supplier Part Number 7: 311-0.0GRCT-ND; Supplier 8: KOA Speer; Supplier Part Number 8: RK73Z1JTTP; Supplier 9: NIC Components; Supplier Part Number 9: NRC06Z0TRF; Quantity Override: 1
R?#62 = RSMT0277: Manufacturer 1: Yageo; Manufacturer Part Number 1: 9T06031A6041FBHFT; Description_: RES TKF 6.04k 1% 1/10W SMD 0603; Dev Tools Status: Production; Voltage: 50V; Temperature Coeffcient: 100ppm/C; Power: 1/10W; Populated: Yes; MCHP-ID: RSMT0277; Package: 0603; Revision: 1; Status: MCL Design; ComponentLink1URL: https://chn-vm-apps.microchip.com/mchprepo/parts/Datasheets/SEI-RMCF_RMCP.pdf; ComponentLink1Description: Datasheet; Operating Temperature: -55C to +155C; Category: Resistor; Type: RES SMD; Composition: TKF; Manufacturer 2: Stackpole Electronics Inc; Manufacturer Part Number 2: RMCF 1/16 6.04K 1% TR; Manufacturer 3: Stackpole Electronics Inc; Manufacturer Part Number 3: RMC 1/16 6.04K 1% TR; Manufacturer 4: Yageo; Manufacturer Part Number 4: 9T06031A6041FBPFT; Supplier 1: Digi-Key; Supplier Part Number 1: 9T06031A6041FBHFT-ND; Supplier 2: Stackpole Electronics Inc; Supplier Part Number 2: RMCF 1/16 6.04K 1% TR; Supplier 3: Stackpole Electronics Inc; Supplier Part Number 3: RMC 1/16 6.04K 1% TR; Supplier 4: Yageo; Supplier Part Number 4: 9T06031A6041FBPFT; Quantity Override: 1
R?#63 R?#75 = RSMT0001: Manufacturer 1: Panasonic; Manufacturer Part Number 1: ERJ-3GSY0R00V; Description_: RES TKF 0R 1/10W SMD 0603; Dev Tools Status: Production; Power: 1/10W; MCHP-ID: RSMT0001; Package: 0603; Revision: 2; Status: MCL Design; ComponentLink1URL: https://chn-vm-apps.microchip.com/mchprepo/parts/Datasheets/nrc.pdf; ComponentLink1Description: Datasheet; Operating Temperature: -55C to +155C; Category: Resistor; Type: RES SMD; Composition: TKF; Manufacturer 2: Panasonic; Manufacturer Part Number 2: ERJ-3GEY0R00V; Manufacturer 3: ROHM; Manufacturer Part Number 3: MCR03EZPJ000; Manufacturer 4: Stackpole Electronics Inc; Manufacturer Part Number 4: RMCF0603ZT0R00; Manufacturer 5: Stackpole Electronics Inc; Manufacturer Part Number 5: RMCF 1/16 0 R; Manufacturer 6: Vishay; Manufacturer Part Number 6: CRCW06030000Z0EA; Manufacturer 7: Yageo; Manufacturer Part Number 7: RC0603JR-070RL; Manufacturer 8: KOA Speer; Manufacturer Part Number 8: RK73Z1JTTP; Manufacturer 9: NIC Components; Manufacturer Part Number 9: NRC06Z0TRF; Supplier 1: Digi-Key; Supplier Part Number 1: P0.0GTR-ND; Supplier 2: Digi-Key; Supplier Part Number 2: RHM0.0GCT-ND; Supplier 3: Digi-Key; Supplier Part Number 3: RMCF0603ZT0R00TR-ND; Supplier 4: Digi-Key; Supplier Part Number 4: RMCF0603ZT0R00CT-ND; Supplier 5: Digi-Key; Supplier Part Number 5: RMCF1/160RTR-ND; Supplier 6: Digi-Key; Supplier Part Number 6: 541-0.0GCT-ND; Supplier 7: Digi-Key; Supplier Part Number 7: 311-0.0GRCT-ND; Supplier 8: KOA Speer; Supplier Part Number 8: RK73Z1JTTP; Supplier 9: NIC Components; Supplier Part Number 9: NRC06Z0TRF; Quantity Override: 1
R?#66-R?#72 = RES1052: Manufacturer 1: Vishay; Manufacturer Part Number 1: CRCW0603750RFKEA; Tolerance: 1%; Description_: RES TKF 750R 1% 1/10W SMD 0603; Dev Tools Status: Production; Voltage: 75V; Temperature Coeffcient: 100ppm/C; Power: 1/10W; Owner: Tad Ahlvers; Populated: YES; MCHP-ID: RES1052; Package: 0603; Revision: 1; Status: MCL Design; ComponentLink1URL: https://chn-vm-apps.microchip.com/mchprepo/parts/Datasheets/dcrcwe3.pdf; ComponentLink1Description: Datasheet; Operating Temperature: -55C to +155C; Category: Resistor; Type: RES SMD; Composition: TKF; Supplier 1: Digi-Key; Supplier Part Number 1: 541-750HCT-ND; Quantity Override: 1
SW? = Switch DIP 8 Pos: Switch DIP SPST 8POS SMD; Manufacturer 1: TE Connectivity Alcoswitch Switches; Manufacturer Part Number 1: 1-1825058-9; Description_: SWITCH SLIDE SPST 24V 100mA 1825058-9EXT ACT 8POS 24V; Voltage Rating: 24VDC; Populated: Yes; Supplier 1: Mouser; Supplier 2: Digi-Key; RoHS: Yes; ComponentLink1URL: http://www.te.com/commerce/DocumentDelivery/DDEController?Action=srchrtrv&DocNm=1825058&DocType=Customer+Drawing&DocLang=English; ComponentLink1Description: http://www.te.com/commerce/DocumentDelivery/DDEController?Action=srchrtrv&DocNm=1825058&DocType=Customer+Drawing&DocLang=English; Supplier Part Number 1: 506-ADE08S04; Supplier Part Number 2: 1-1825058-9-ND; Value: SPST 8POS
TP? = TEST PAD TH 51X36: Manufacturer Part Number: none; Description_: TEST Pad, PIN sized, 51pad, 36 FHS; Populated: Yes; Manufacturer: none; Category: Non BOM Item; Type: Male; Mounting Type: Through Hole; Supplier 1: none; Supplier Part Number 1: none
U?#32 U?#34 = KSZ9477S_TQFP128: IC, 7-Port Gigabit Ethernet Switch with 2 RGMII / MII / RMII Interfaces, TQFP128; Manufacturer 1: Micrel; Populated: Yes; Owner: sam charles; Manufacturer Part Number 1: KSZ9477S; Description_: IC, 7-Port Gigabit Ethernet Switch with 2 RGMII / MII / RMII Interfaces, TQFP128; Revision Date: 06/03/2016; RoHS: Yes; Package: TQFP128-14x14; Document Link: http://nyusperforce.smsc.com//depot_np_hweng_boards/altium_libraries/datasheets/_Microchip/_Micrel/KSZ9897R.pdf; Status: New; Value: KSZ9477S
U?#33 = MIC23303YML: 4MHz PWM 3A Buck Regulator with HyperLight Load and Power Good; Part Checked: Carl Johnson; Manufacturer 1: Microchip Technology; Populated: Yes; Temperature Rating: -40 to +125 C; Description_: 4MHz PWM 3A Buck Regulator with HyperLight Load and Power Good; Document Link: http://nyusperforce.smsc.com//depot_np_hweng_boards/altium_libraries/datasheets/_Microchip/_Micrel/MIC23303.pdf; Owner: *; Part 3D Model Checked: *; Part Footprint Checked: *; Part Golden: *; Revision Date: 06/20/16; Package: DFN12-3x3; Manufacturer Part Number 1: MIC23303YML; Supplier 1: DigiKey; Supplier 2: Mouser; Supplier Part Number 1: 1611-MIC23303YML-T5CT-ND; Supplier Part Number 2: 998-MIC23303YMLT5; Value: MIC23303YML
Y? = XTAL 25MHz 4 pins 3225: Crystal 25MHz 4 pins 3225; Manufacturer 1: Murata Electronics North America; Manufacturer Part Number 1: ABM8G-25.000MHZ-B4Y-T; Frequency Stability: ±20ppm; Frequency Tolerance: ±30ppm; Load Capacitance: 6pF; Operating Mode: Fundamental; Populated: Yes; Description_: Crystal 25MHz 6pF SMD 4Pin DFN LCC; Revision: A; RoHS: RoHS Compliant; Category: Crystals and Oscillators; Packaging: Cut Tape (CT); Type: MHz Crystal; Operating Temperature: -30°C ~ 85°C; Package / Case: 4-SMD, No Lead (DFN, LCC); Size / Dimension: 3.2 mm x 2.5mm; ComponentLink1URL: http://search.murata.co.jp/Ceramy/image/img/w_hinm/; ComponentLink1Description: http://search.murata.co.jp/Ceramy/image/img/w_hinm/; Supplier 1: Mouser; Supplier Part Number 1: 815-ABM8G-25-B4Y-T

## Nets that join several sheets
3V3: Sheet11 (28 pins), Sheet13 (C?#173.2 OSC?.6 R?#73.2)
+3.3V: Sheet4 (C?#74.1 U?#17.1), Sheet6 (11 pins), Sheet9 (20 pins)
+VCCAUX: Sheet2 (8 pins), Sheet4 (FB?#4.2 R?#1.1 R?#6.1 R?#7.1)
+VCCINT: Sheet2 (28 pins), Sheet4 (R?#3.1)
+VCCO_PSIO: Sheet2 (19 pins), Sheet6 (10 pins)
GND: Sheet2 (205 pins), Sheet4 (8 pins), Sheet6 (25 pins), Sheet9 (40 pins), Sheet10 (R?#37.1), Sheet11 (80 pins), Sheet13 (79 pins)
GND_SYSMON: Sheet2 (U?#14.W20), Sheet4 (10 pins)